# EAGLE schematic pinheader_pigoda (EAGLE 7.6.0)
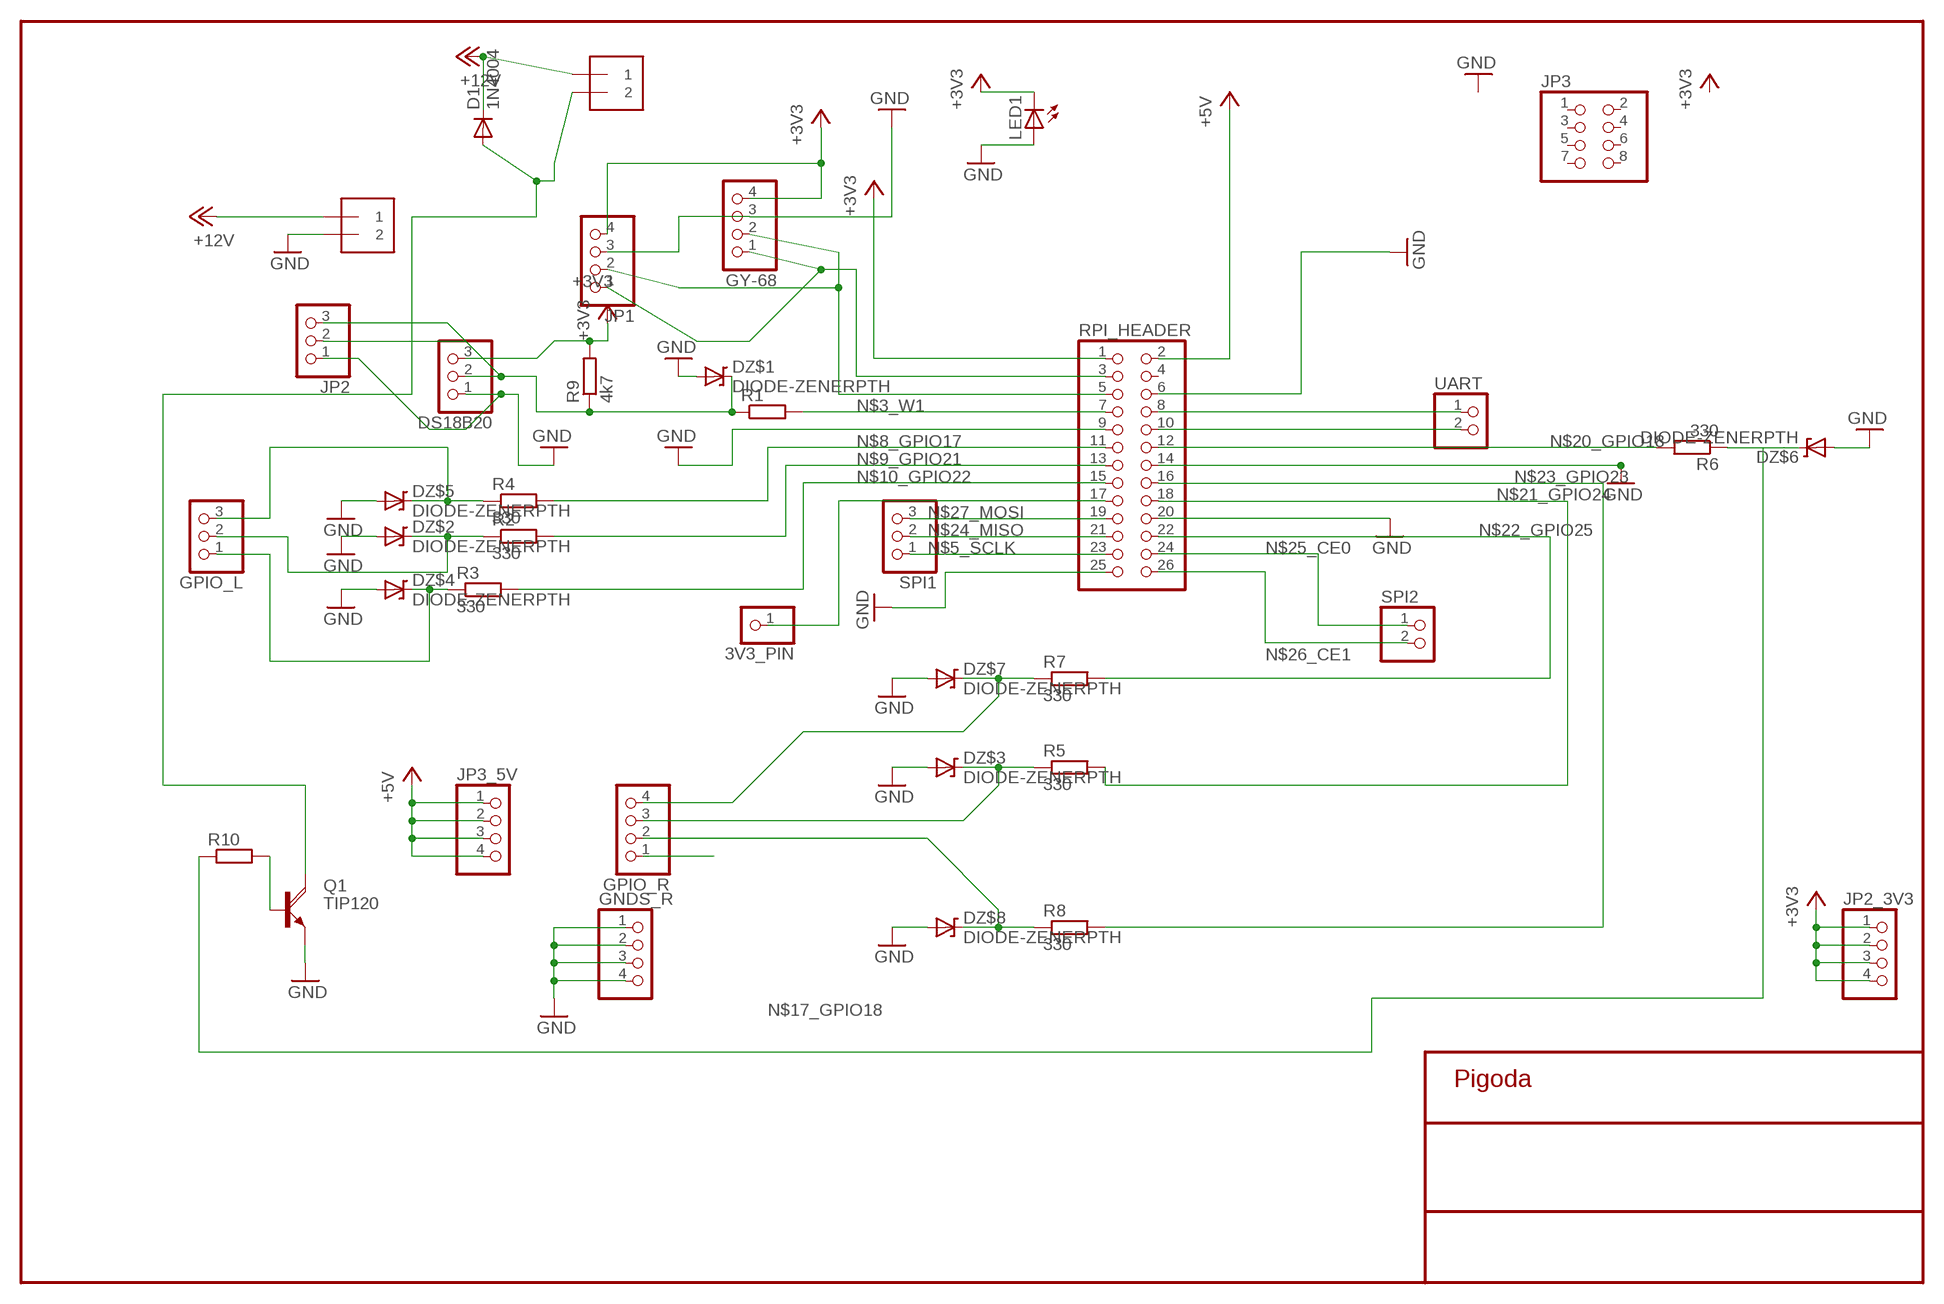
[diagram p0: schematic, sheet 1]

## Parts
3V3_PIN  PINHD-1X1  [1X01]
12V_IN  1X2-3.5MM  [1X2-3.5MM]
12V_IOUT  1X2-3.5MM  [1X2-3.5MM]
D1  1N4004  [DO41-10]
DS18B20  PINHD-1X3  [1X03]
DZ$1  DIODE-ZENERPTH  [DIODE-ZENER]
DZ$2  DIODE-ZENERPTH  [DIODE-ZENER]
DZ$3  DIODE-ZENERPTH  [DIODE-ZENER]
DZ$4  DIODE-ZENERPTH  [DIODE-ZENER]
DZ$5  DIODE-ZENERPTH  [DIODE-ZENER]
DZ$6  DIODE-ZENERPTH  [DIODE-ZENER]
DZ$7  DIODE-ZENERPTH  [DIODE-ZENER]
DZ$8  DIODE-ZENERPTH  [DIODE-ZENER]
GNDS_R  PINHD-1X4  [1X04]
GPIO_L  PINHD-1X3  [1X03]
GPIO_R  PINHD-1X4  [1X04]
GY-68  PINHD-1X4  [1X04]
JP1  PINHD-1X4  [1X04]
JP2  PINHD-1X3  [1X03]
JP2_3V3  PINHD-1X4  [1X04]
JP3  PINHD-2X4/90  [2X04/90]
JP3_5V  PINHD-1X4  [1X04]
LED1  LED3MM  [LED3MM]
Q1  TIP120  [TO220AH]
R1  R-EU_0204/7  [0204/7]
R2  330  R-EU_0204/7  [0204/7]
R3  330  R-EU_0204/7  [0204/7]
R4  330  R-EU_0204/7  [0204/7]
R5  330  R-EU_0204/7  [0204/7]
R6  330  R-EU_0204/7  [0204/7]
R7  330  R-EU_0204/7  [0204/7]
R8  330  R-EU_0204/7  [0204/7]
R9  4k7  R-EU_0204/5  [0204/5]
R10  R-EU_0204/5  [0204/5]
RPI_HEADER  PINHD-2X13  [2X13]
SPI1  PINHD-1X3  [1X03]
SPI2  PINHD-1X2  [1X02]
UART  PINHD-1X2  [1X02]

## Nets
+3V3: DS18B20.3 GY-68.4 JP1.4 JP2.3 JP2_3V3.1 JP2_3V3.2 JP2_3V3.3 JP2_3V3.4 LED1.K(C) R9.2 RPI_HEADER.1
+5V: JP3_5V.1 JP3_5V.2 JP3_5V.3 JP3_5V.4 RPI_HEADER.2
+12V: 12V_IN.1 12V_IOUT.1 D1.C
GND: 12V_IN.2 DS18B20.1 DZ$1.P$2(A) DZ$2.P$2(A) DZ$3.P$2(A) DZ$4.P$2(A) DZ$5.P$2(A) DZ$6.P$2(A) DZ$7.P$2(A) DZ$8.P$2(A) GNDS_R.1 GNDS_R.2 GNDS_R.3 GNDS_R.4 GY-68.3 JP1.3 JP2.1 LED1.A Q1.E RPI_HEADER.6 RPI_HEADER.9 RPI_HEADER.14 RPI_HEADER.20 RPI_HEADER.25
N$1: DZ$2.P$1(C) GPIO_L.2 R2.1
N$2: DS18B20.2 DZ$1.P$1(C) JP2.2 R1.1 R9.1
N$3_W1: R1.2 RPI_HEADER.7
N$4: DZ$4.P$1(C) GPIO_L.1 R3.1
N$5_SCLK: RPI_HEADER.23 SPI1.1
N$7: DZ$5.P$1(C) GPIO_L.3 R4.1
N$8_GPIO17: R4.2 RPI_HEADER.11
N$9_GPIO21: R2.2 RPI_HEADER.13
N$10_GPIO22: R3.2 RPI_HEADER.15
N$11: Q1.B R10.2
N$12: GY-68.1 JP1.1 RPI_HEADER.3
N$13: 3V3_PIN.1 RPI_HEADER.17
N$14: DZ$3.P$1(C) GPIO_R.3 R5.1
N$15: RPI_HEADER.8 UART.1
N$16: RPI_HEADER.10 UART.2
N$17_GPIO18: DZ$6.P$1(C) R6.1 R10.1
N$18: DZ$7.P$1(C) GPIO_R.4 R7.1
N$19: DZ$8.P$1(C) GPIO_R.2 R8.1
N$20_GPIO18: R6.2 RPI_HEADER.12
N$21_GPIO24: R5.2 RPI_HEADER.18
N$22_GPIO25: R7.2 RPI_HEADER.22
N$23_GPIO23: R8.2 RPI_HEADER.16
N$24_MISO: RPI_HEADER.21 SPI1.2
N$25_CE0: RPI_HEADER.24 SPI2.1
N$26_CE1: RPI_HEADER.26 SPI2.2
N$27_MOSI: RPI_HEADER.19 SPI1.3
N$31: GPIO_R.1
N$32: GY-68.2 JP1.2 RPI_HEADER.5
N$33: 12V_IOUT.2 D1.A Q1.C
Unconnected: JP3.1 JP3.2 JP3.3 JP3.4 JP3.5 JP3.6 JP3.7 JP3.8 RPI_HEADER.4

## Notes on the sheet
- Pigoda

## Library data of the parts
3V3_PIN = pinhead:PINHD-1X1: PIN HEADER
12V_IN 12V_IOUT = adafruit:1X2: 3.5mm Terminal block http://www.ladyada.net/library/pcb/eaglelibrary.html
D1 = adafruit:1N4004: DIODE General purpose 1N400x type rectifier (With bigger pads) http://www.ladyada.net/library/pcb/eaglelibrary.html
DS18B20 GPIO_L JP2 SPI1 = pinhead:PINHD-1X3: PIN HEADER
DZ$1-DZ$8 = Johnboiles:DIODE-ZENER: Zener Diode Production Part - 8199 3.4V Zener Voltage
GNDS_R GPIO_R GY-68 JP1 JP2_3V3 JP3_5V = pinhead:PINHD-1X4: PIN HEADER
JP3 = pinhead:PINHD-2X4: PIN HEADER
LED1 = adafruit:LED: LED OSRAM: - CHIPLED LG R971, LG N971, LY N971, LG Q971, LY Q971, LO R971, LY R971 LH N974, LH R974 LS Q976, LO Q976, LY Q976 LO Q996 - Hyper CHIPLED LW Q18S LB Q993, LB Q99A, LB R99A - SideLED LS A670, LO A670, LY A670, LG A670, LP A670 LB A673, LV A673, LT A673, LW A673 LH A674 LY A675 LS A676, LA A676, LO A676, LY A676, LW A676 LS A679, LY A679, LG A679 - Hyper Micro SIDELED® LS Y876, LA Y876, LO Y876, LY Y876 LT Y87S - SmartLED LW L88C, LW L88S LB L89C, LB L89S, LG L890 LS L89K, LO L89K, LY L89K LS L896, LA L896, LO L896, LY L896 - TOPLED LS T670, LO T670, LY T670, LG T670, LP T670 LSG T670, LSP T670, LSY T670, LOP T670, LYG T670 LG T671, LOG T671, LSG T671 LB T673, LV T673, LT T673, LW T673 LH T674 LS T676, LA T676, LO T676, LY T676, LB T676, LH T676, LSB T676, LW T676 LB T67C, LV T67C, LT T67C, LS T67K, LO T67K, LY T67K, LW E67C LS E67B, LA E67B, LO E67B, LY E67B, LB E67C, LV E67C, LT E67C LW T67C LS T679, LY T679, LG T679 LS T770, LO T770, LY T770, LG T770, LP T770 LB T773, LV T773, LT T773, LW T773 LH T774 LS E675, LA E675, LY E675, LS T675 LS T776, LA T776, LO T776, LY T776, LB T776 LHGB T686 LT T68C, LB T68C - Hyper Mini TOPLED® LB M676 - Mini TOPLED Santana® LG M470 LS M47K, LO M47K, LY M47K Source: http://www.osram.convergy.de/
Q1 = transistor-power:TIP120: NPN DARLINGTON TRANSISTOR
R1-R10 = resistor:R-EU_: RESISTOR, European symbol
RPI_HEADER = pinhead:PINHD-2X13: PIN HEADER
SPI2 UART = pinhead:PINHD-1X2: PIN HEADER